# Altium schematic sheet homecomputer-6502_1.SchDoc: homecomputer-6502
size 286 x 202 mm; Date: 2018/12/4 21:08:23; SheetNumber: 2
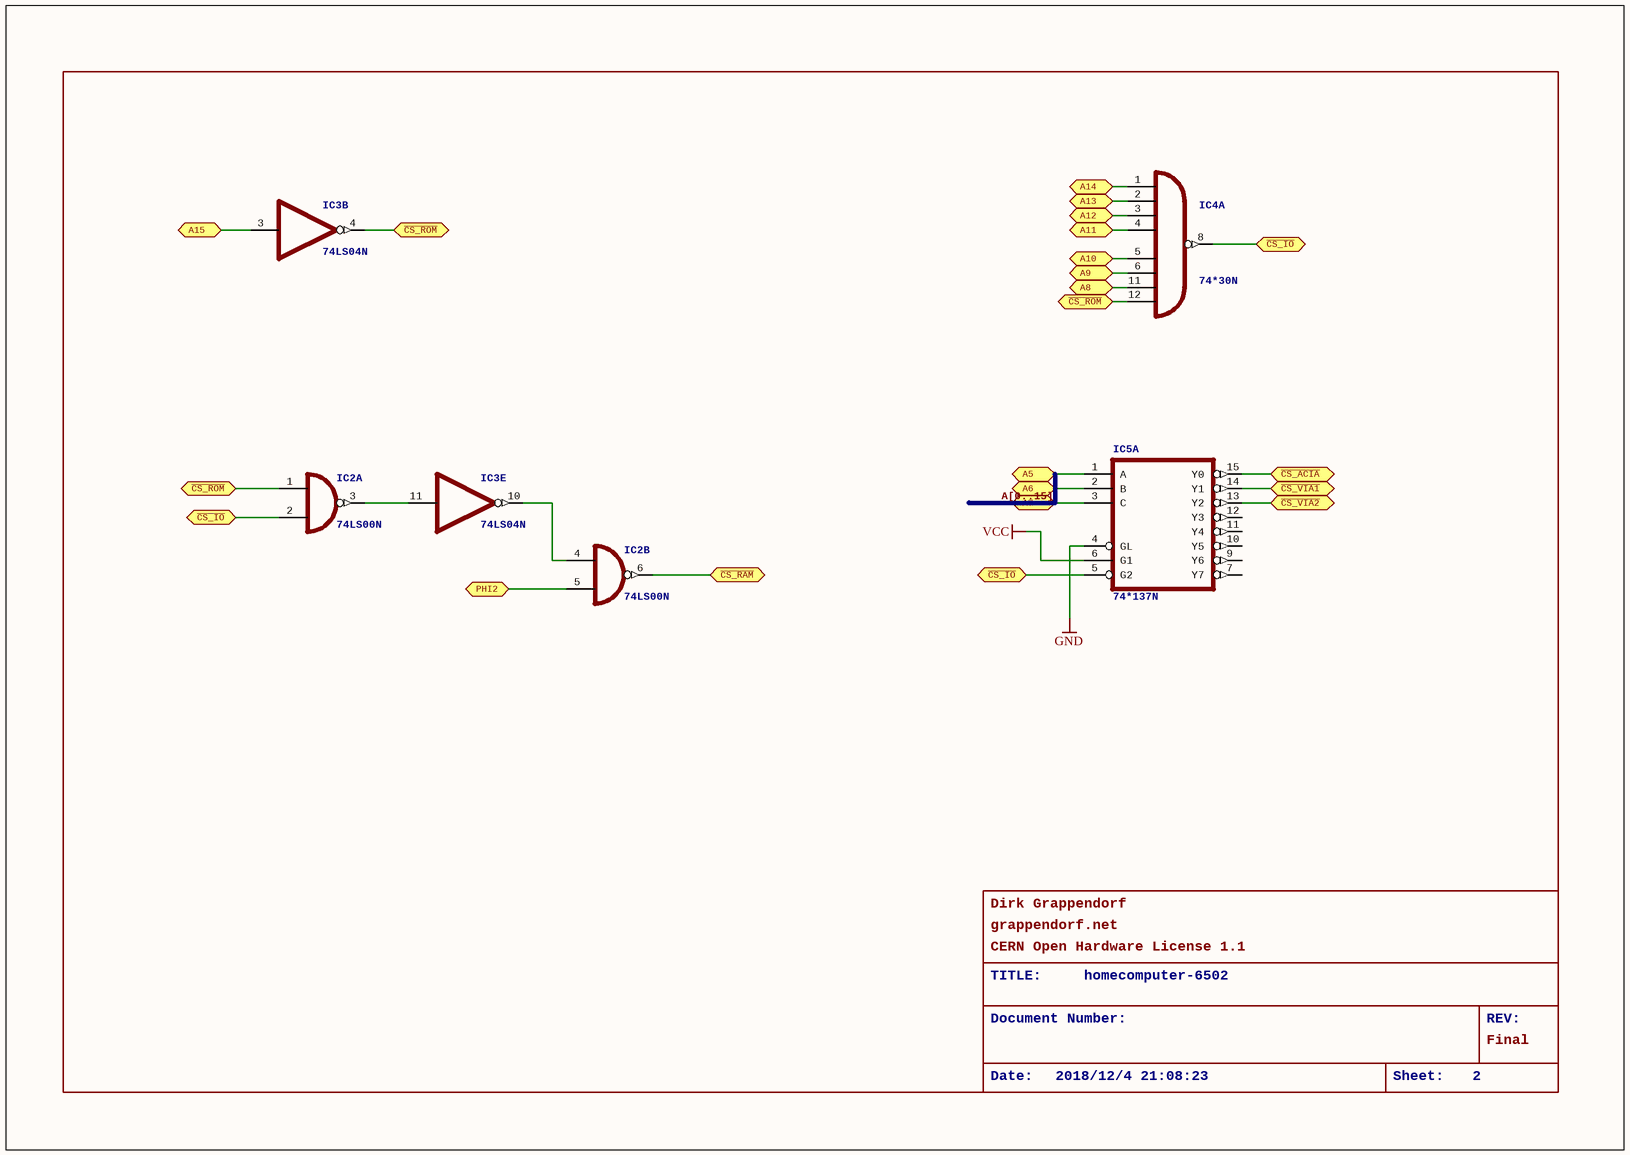
[diagram p0: homecomputer-6502_1.SchDoc]

## Parts
IC2  74LS00N  [DIL14]  (parts A,B of 5)
IC3  74LS04N  [DIL14]  (parts B,E of 7)
IC4  74*30N  [DIL14]  (part A of 2)
IC5  74*137N  [DIL16]  (part A of 2)

## Ports
A5, A6, A7, A8, A9, A10, A11, A12, A13, A14, A15, PHI2, ~{CS_ACIA}, ~{CS_IO}, ~{CS_RAM}, ~{CS_ROM}, ~{CS_VIA1}, ~{CS_VIA2}

## Nets
GND: IC5.4(GL)
VCC: IC5.6(G1)
A5: IC5.1(A) ; port A5
A7: IC5.3(C) ; port A7
A8: IC4.11(I6) ; port A8
A9: IC4.6(I5) ; port A9
A10: IC4.5(I4) ; port A10
A11: IC4.4(I3) ; port A11
A12: IC4.3(I2) ; port A12
A13: IC4.2(I1) ; port A13
A14: IC4.1(I0) ; port A14
A15: IC3.3(I) ; port A15
A[0..15]: IC5.2(B) ; port A6
~{CS_ACIA}: IC5.15(Y0) ; port ~{CS_ACIA}
~{CS_IO}: IC2.2(I1) IC4.8(O) IC5.5(G2) ; port ~{CS_IO}
~{CS_RAM}: IC2.6(O) ; port ~{CS_RAM}
~{CS_ROM}: IC2.1(I0) IC3.4(O) IC4.12(I7) ; port ~{CS_ROM}
~{CS_VIA1}: IC5.14(Y1) ; port ~{CS_VIA1}
~{CS_VIA2}: IC5.13(Y2) ; port ~{CS_VIA2}
PHI2: IC2.5(I1) ; port PHI2
NetIC2_3: IC2.3(O) IC3.11(I)
NetIC2_4: IC2.4(I0) IC3.10(O)

Not connected (* = marked no-connect by the designer): IC5 7(Y7) 9(Y6) 10(Y5) 11(Y4) 12(Y3)

## Notes on the sheet
- Dirk Grappendorf
- grappendorf.net
- CERN Open Hardware License 1.1
- TITLE:
- Document Number:
- homecomputer-6502
- REV:
- Date:
- 2018/12/4 21:08:23
- Sheet:
- 2
- Final

## Library data of the parts
IC2 = 74*00N: Quad 2-input NAND gate
IC3 = 74*04N: Hex INVERTER
IC4 = 74*30N: 8-input NAND gate
IC5 = 74*137N: 3-line to 8-line DECODER/DEMULTIPLEXER, address LATCH